# Altium schematic sheet Sheet1.SchDoc
size A4
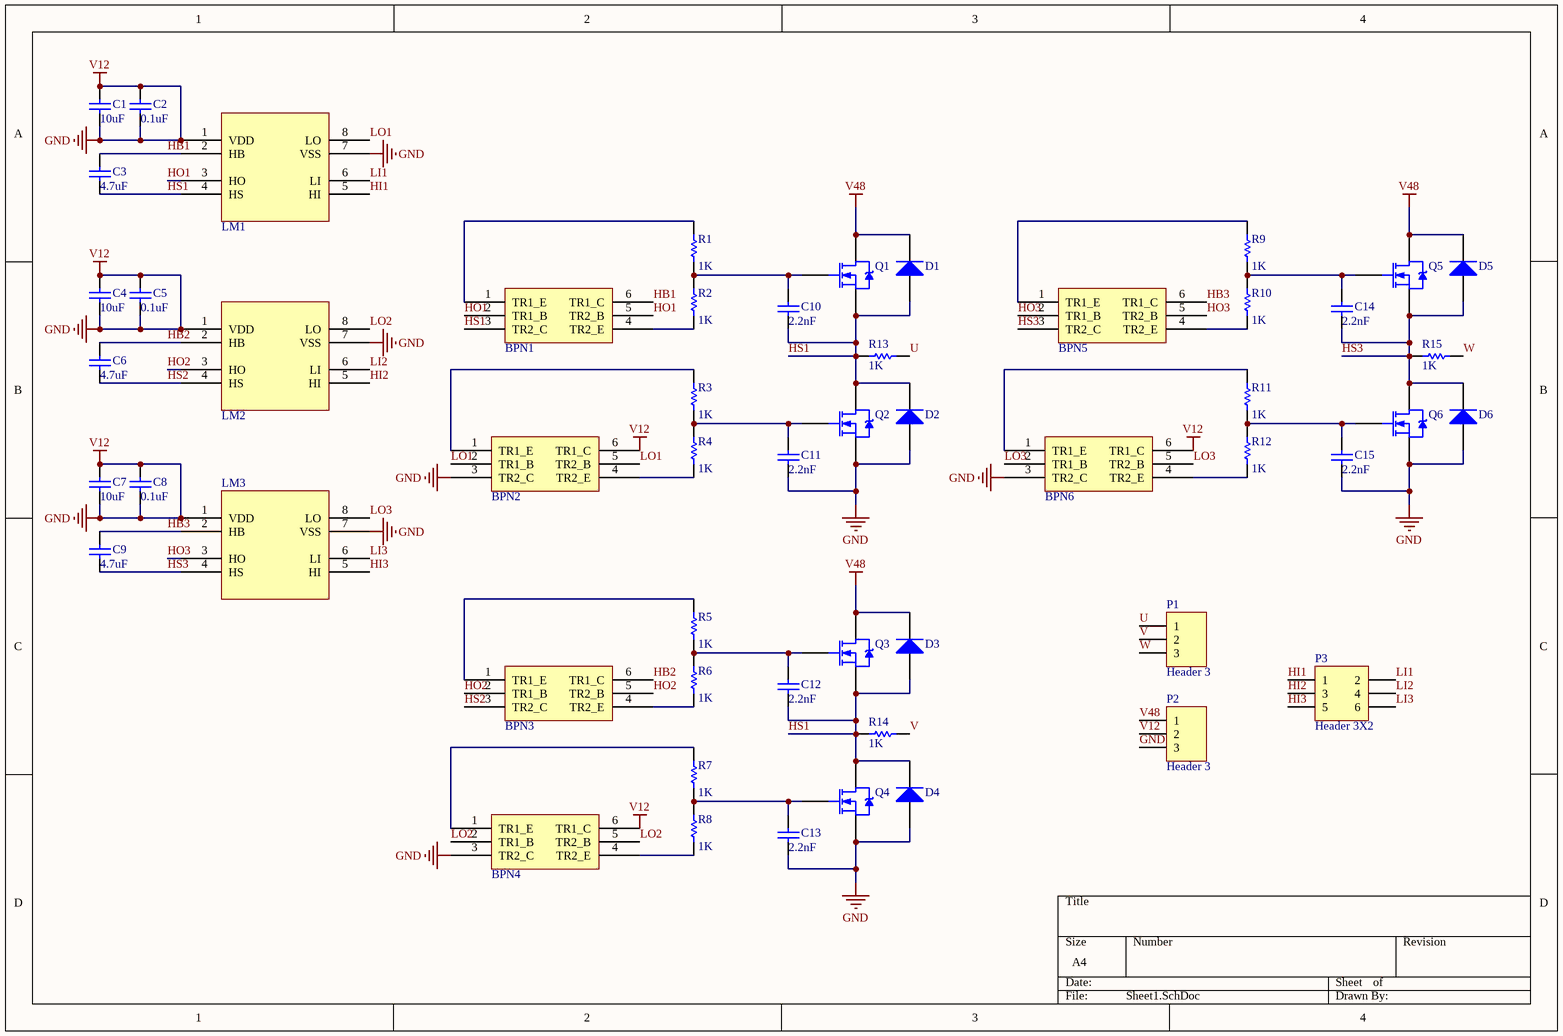
[diagram p0: Sheet1.SchDoc]

## Parts
BPN1  BPN1  [BC847BPN]
BPN2  BPN2  [BC847BPN]
BPN3  BPN3  [BC847BPN]
BPN4  BPN4  [BC847BPN]
BPN5  BPN5  [BC847BPN]
BPN6  BPN6  [BC847BPN]
C1  value 10uF  [6-0805_M]  (hidden comment: Cap)
C2  value 0.1uF  [6-0805_M]  (hidden comment: Cap)
C3  value 4.7uF  [6-0805_M]  (hidden comment: Cap)
C4  value 10uF  [6-0805_M]  (hidden comment: Cap)
C5  value 0.1uF  [6-0805_M]  (hidden comment: Cap)
C6  value 4.7uF  [6-0805_M]  (hidden comment: Cap)
C7  value 10uF  [6-0805_M]  (hidden comment: Cap)
C8  value 0.1uF  [6-0805_M]  (hidden comment: Cap)
C9  value 4.7uF  [6-0805_M]  (hidden comment: Cap)
C10  value 2.2nF  [6-0805_M]  (hidden comment: Cap)
C11  value 2.2nF  [6-0805_M]  (hidden comment: Cap)
C12  value 2.2nF  [6-0805_M]  (hidden comment: Cap)
C13  value 2.2nF  [6-0805_M]  (hidden comment: Cap)
C14  value 2.2nF  [6-0805_M]  (hidden comment: Cap)
C15  value 2.2nF  [6-0805_M]  (hidden comment: Cap)
D1  Diode 1N914  [12Z-2010]  (value not drawn)
D2  Diode 1N914  [12Z-2010]  (value not drawn)
D3  Diode 1N914  [12Z-2010]  (value not drawn)
D4  Diode 1N914  [12Z-2010]  (value not drawn)
D5  Diode 1N914  [12Z-2010]  (value not drawn)
D6  Diode 1N914  [12Z-2010]  (value not drawn)
LM1  LM1  [LM5101A]
LM2  LM2  [LM5101A]
LM3  LM3  [LM5101A]  (value not drawn)
P1  Header 3  [HDR1X3]
P2  Header 3  [HDR1X3]
P3  Header 3X2  [HDR2X3]
Q1  NMOS-2  [SOT-23_M]  (value not drawn)
Q2  NMOS-2  [SOT23_M]  (value not drawn)
Q3  NMOS-2  [SOT-23_M]  (value not drawn)
Q4  NMOS-2  [SOT23_M]  (value not drawn)
Q5  NMOS-2  [SOT-23_M]  (value not drawn)
Q6  NMOS-2  [SOT23_M]  (value not drawn)
R1  value 1K  [6-0805_M]  (hidden comment: Res1)
R2  value 1K  [6-0805_M]  (hidden comment: Res1)
R3  value 1K  [6-0805_M]  (hidden comment: Res1)
R4  value 1K  [6-0805_M]  (hidden comment: Res1)
R5  value 1K  [6-0805_M]  (hidden comment: Res1)
R6  value 1K  [6-0805_M]  (hidden comment: Res1)
R7  value 1K  [6-0805_M]  (hidden comment: Res1)
R8  value 1K  [6-0805_M]  (hidden comment: Res1)
R9  value 1K  [6-0805_M]  (hidden comment: Res1)
R10  value 1K  [6-0805_M]  (hidden comment: Res1)
R11  value 1K  [6-0805_M]  (hidden comment: Res1)
R12  value 1K  [6-0805_M]  (hidden comment: Res1)
R13  value 1K  [6-0805_M]  (hidden comment: Res1)
R14  value 1K  [6-0805_M]  (hidden comment: Res1)
R15  value 1K  [6-0805_M]  (hidden comment: Res1)

## Nets
GND: BPN2.3(TR2_C) BPN2.6(TR1_C) BPN4.3(TR2_C) BPN4.6(TR1_C) BPN6.3(TR2_C) BPN6.6(TR1_C) C1.1 C1.2 C2.1 C2.2 C4.1 C4.2 C5.1 C5.2 C7.1 C7.2 C8.1 C8.2 C11.1 C13.1 C15.1 D2.1(A) D4.1(A) D6.1(A) LM1.1(VDD) LM1.7(VSS) LM2.1(VDD) LM2.7(VSS) LM3.1(VDD) LM3.7(VSS) P2.2 P2.3 Q2.3(S) Q4.3(S) Q6.3(S)  [also labelled V12]
V48: D1.2(K) D3.2(K) D5.2(K) P2.1 Q1.2(D) Q3.2(D) Q5.2(D)
HB1: BPN1.6(TR1_C) C3.2 LM1.2(HB)
HB2: BPN3.6(TR1_C) C6.2 LM2.2(HB)
HB3: BPN5.6(TR1_C) C9.2 LM3.2(HB)
HI1: LM1.5(HI) P3.1
HI2: LM2.5(HI) P3.3
HI3: LM3.5(HI) P3.5
HO1: BPN1.2(TR1_B) BPN1.5(TR2_B) LM1.3(HO)
HO2: BPN3.2(TR1_B) BPN3.5(TR2_B) LM2.3(HO)
HO3: BPN5.2(TR1_B) BPN5.5(TR2_B) LM3.3(HO)
HS1: BPN1.3(TR2_C) C3.1 C10.1 C12.1 D1.1(A) D2.2(K) D3.1(A) D4.2(K) LM1.4(HS) Q1.3(S) Q2.2(D) Q3.3(S) Q4.2(D) R13.2 R14.2
HS2: BPN3.3(TR2_C) C6.1 LM2.4(HS)
HS3: BPN5.3(TR2_C) C9.1 C14.1 D5.1(A) D6.2(K) LM3.4(HS) Q5.3(S) Q6.2(D) R15.2
LI1: LM1.6(LI) P3.2
LI2: LM2.6(LI) P3.4
LI3: LM3.6(LI) P3.6
LO1: BPN2.2(TR1_B) BPN2.5(TR2_B) LM1.8(LO)
LO2: BPN4.2(TR1_B) BPN4.5(TR2_B) LM2.8(LO)
LO3: BPN6.2(TR1_B) BPN6.5(TR2_B) LM3.8(LO)
U: P1.1 R13.1
V: P1.2 R14.1
W: P1.3 R15.1
NetBPN1_1: BPN1.1(TR1_E) R1.2
NetBPN1_4: BPN1.4(TR2_E) R2.1
NetBPN2_1: BPN2.1(TR1_E) R3.2
NetBPN2_4: BPN2.4(TR2_E) R4.1
NetBPN3_1: BPN3.1(TR1_E) R5.2
NetBPN3_4: BPN3.4(TR2_E) R6.1
NetBPN4_1: BPN4.1(TR1_E) R7.2
NetBPN4_4: BPN4.4(TR2_E) R8.1
NetBPN5_1: BPN5.1(TR1_E) R9.2
NetBPN5_4: BPN5.4(TR2_E) R10.1
NetBPN6_1: BPN6.1(TR1_E) R11.2
NetBPN6_4: BPN6.4(TR2_E) R12.1
NetC10_2: C10.2 Q1.1(G) R1.1 R2.2
NetC11_2: C11.2 Q2.1(G) R3.1 R4.2
NetC12_2: C12.2 Q3.1(G) R5.1 R6.2
NetC13_2: C13.2 Q4.1(G) R7.1 R8.2
NetC14_2: C14.2 Q5.1(G) R9.1 R10.2
NetC15_2: C15.2 Q6.1(G) R11.1 R12.2

## Library data of the parts
BPN1-BPN6 = BC847BPN
C1-C15 = Cap: Capacitor; Published: 8-Jun-2000; LatestRevisionDate: 17-Jul-2002; LatestRevisionNote: Re-released for DXP Platform.; PackageReference: RAD-0.3; Publisher: Altium Limited; PackageDescription: Radial Cap, Thru-Hole; 2 Leads; 0.3 in Pin Spacing
D1-D6 = Diode 1N914: High Conductance Fast Diode; Published: 8-Jun-2000; LatestRevisionDate: 17-Jul-2002; LatestRevisionNote: Re-released for DXP Platform.; DatasheetVersion: 1997; PackageReference: DO-35; Publisher: Altium Limited; PackageDescription: Diode, Axial; Body 3.8 x 1.9 mm (LxDia. max), Lead Dia. 0.53 mm (max); Code_JEDEC: DO-204-AH; ComponentLink1Description: Manufacturer Link; ComponentLink1URL: http://www.fairchildsemi.com/; ComponentLink2Description: Datasheet; ComponentLink2URL: http://www.fairchildsemi.com/ds/1N%2F1N4448.pdf
LM1-LM3 = LM5101A
P1 P2 = Header 3: Header, 3-Pin; LatestRevisionDate: 17-Jul-2002; LatestRevisionNote: Re-released for DXP Platform.; Publisher: Altium Limited
P3 = Header 3X2: Header, 3-Pin, Dual row; LatestRevisionDate: 17-Jul-2002; LatestRevisionNote: Re-released for DXP Platform.; Publisher: Altium Limited
Q1-Q6 = NMOS-2: N-Channel Power MOSFET; Note: Pin 2 is electrically connected to pin 4.; Published: 8-Jun-2000; LatestRevisionDate: 17-Jul-2002; LatestRevisionNote: Re-released for DXP Platform.; DatasheetVersion: PD-9.814; PackageVersion: Feb-1997; PackageReference: TO-220AB; Publisher: Altium Limited; PackageDescription: TO, Thru-Hole, Vertical, Heatsink Mounted; 3 In-Line Leads; Pitch 2.54 mm; ComponentLink1Description: Manufacturer Link; ComponentLink1URL: http://www.irf.com/
R1-R15 = Res1: Resistor; Published: 8-Jun-2000; LatestRevisionDate: 17-Jul-2002; LatestRevisionNote: Re-released for DXP Platform.; PackageReference: AXIAL-0.3; Publisher: Altium Limited; PackageDescription: Axial Device, Thru-Hole; 2 Leads; 0.3 in Pin Spacing